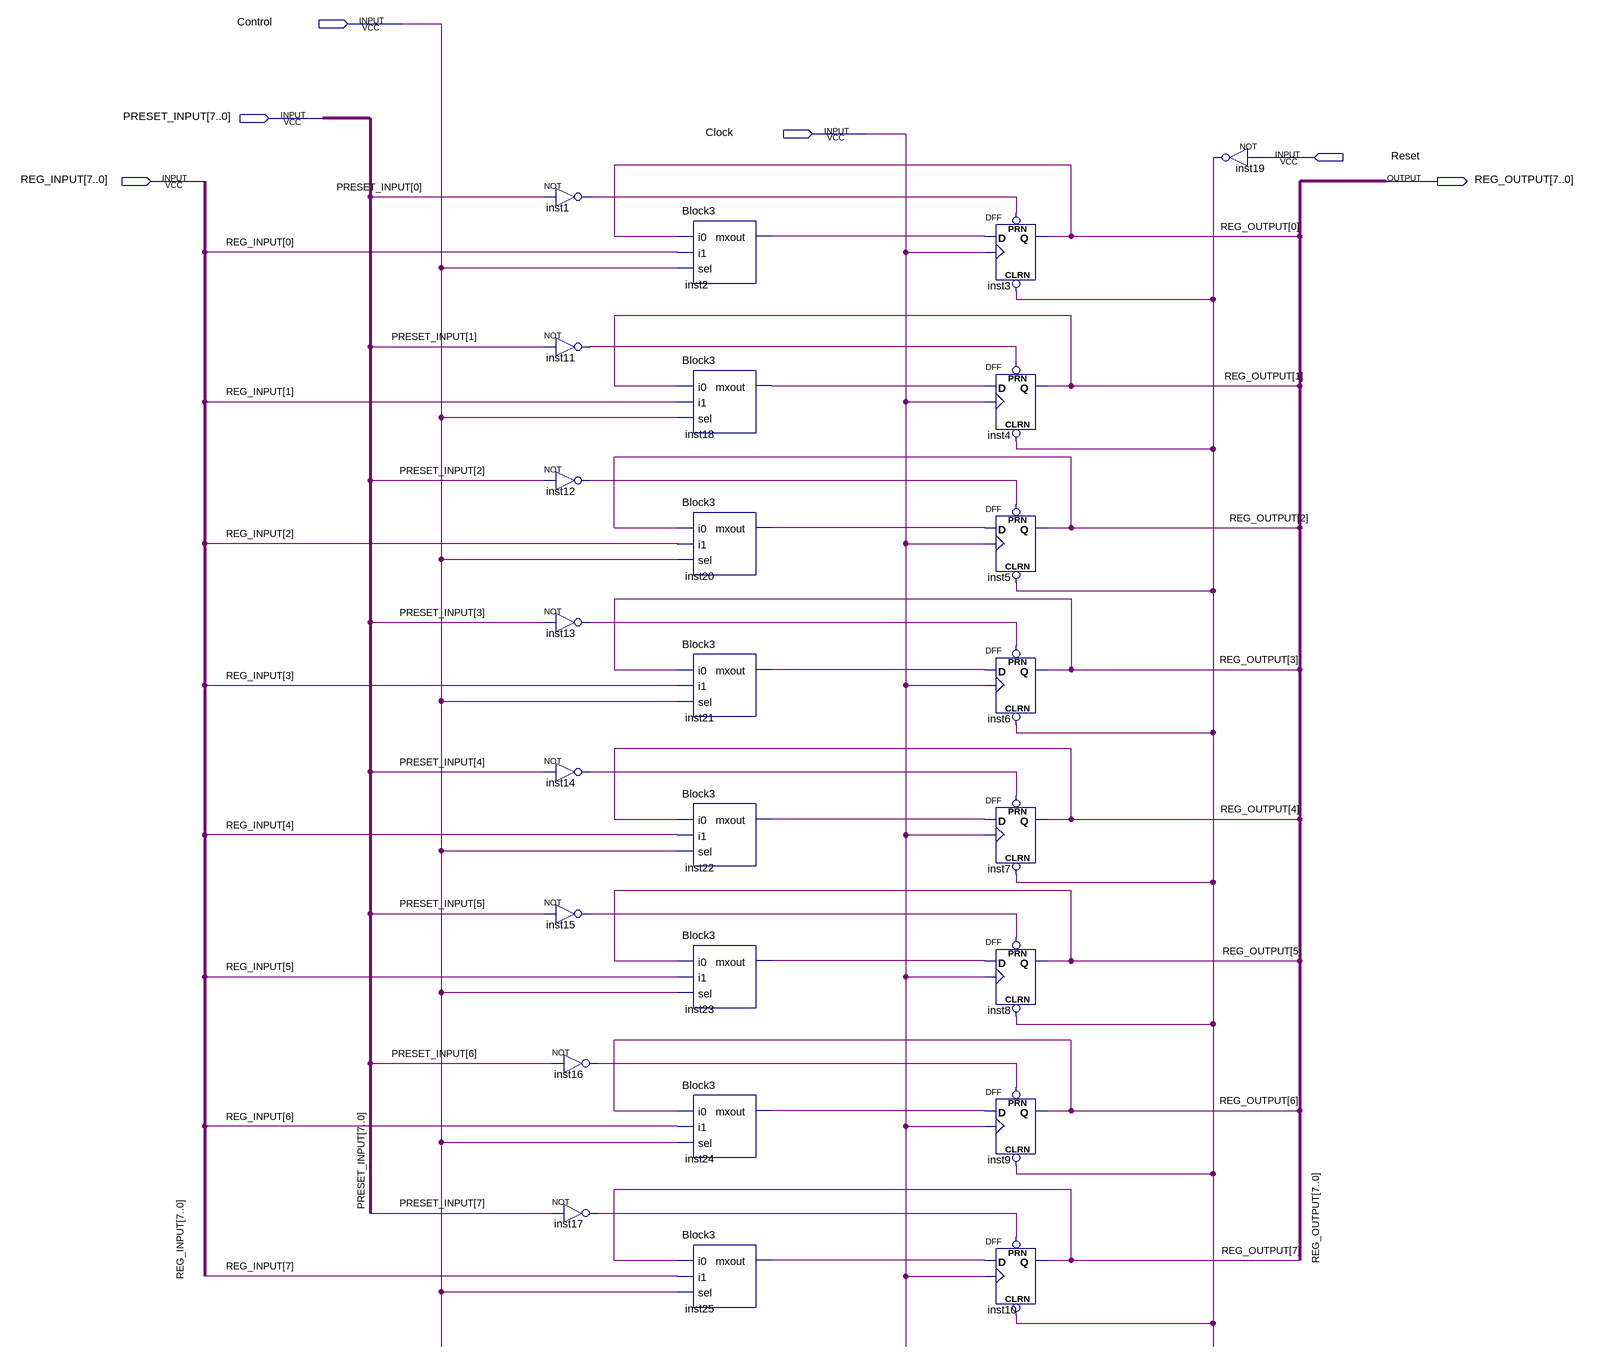
[diagram p0: schematic sheet]
// Quartus schematic Registers8bit_with_preset.bdf as structural Verilog: 25 symbols, 6 pins
module Registers8bit_with_preset (
  input  Control,
  input  [7:0] PRESET_INPUT,
  input  Clock,
  input  Reset,
  input  [7:0] REG_INPUT,
  output [7:0] REG_OUTPUT
);

  wire inst1_out, inst2_mxout, inst11_out, inst12_out, inst13_out, inst14_out, inst15_out, inst16_out,
       inst17_out, inst18_mxout, inst19_out, inst20_mxout, inst21_mxout, inst22_mxout, inst23_mxout,
       inst24_mxout, inst25_mxout;

  not inst1 (inst1_out, PRESET_INPUT[0]);
  not inst11 (inst11_out, PRESET_INPUT[1]);
  not inst12 (inst12_out, PRESET_INPUT[2]);
  not inst13 (inst13_out, PRESET_INPUT[3]);
  not inst14 (inst14_out, PRESET_INPUT[4]);
  not inst15 (inst15_out, PRESET_INPUT[5]);
  not inst16 (inst16_out, PRESET_INPUT[6]);
  not inst17 (inst17_out, PRESET_INPUT[7]);
  Block3 inst2 (.i0(REG_OUTPUT[0]), .i1(REG_INPUT[0]), .sel(Control), .mxout(inst2_mxout));
  Block3 inst18 (.i0(REG_OUTPUT[1]), .i1(REG_INPUT[1]), .sel(Control), .mxout(inst18_mxout));
  Block3 inst20 (.i0(REG_OUTPUT[2]), .i1(REG_INPUT[2]), .sel(Control), .mxout(inst20_mxout));
  Block3 inst21 (.i0(REG_OUTPUT[3]), .i1(REG_INPUT[3]), .sel(Control), .mxout(inst21_mxout));
  Block3 inst22 (.i0(REG_OUTPUT[4]), .i1(REG_INPUT[4]), .sel(Control), .mxout(inst22_mxout));
  Block3 inst23 (.i0(REG_OUTPUT[5]), .i1(REG_INPUT[5]), .sel(Control), .mxout(inst23_mxout));
  Block3 inst24 (.i0(REG_OUTPUT[6]), .i1(REG_INPUT[6]), .sel(Control), .mxout(inst24_mxout));
  Block3 inst25 (.i0(REG_OUTPUT[7]), .i1(REG_INPUT[7]), .sel(Control), .mxout(inst25_mxout));
  DFF inst3 (.CLRN(inst19_out), .CLK(Clock), .D(inst2_mxout), .PRN(inst1_out), .Q(REG_OUTPUT[0]));
  DFF inst4 (.CLRN(inst19_out), .CLK(Clock), .D(inst18_mxout), .PRN(inst11_out), .Q(REG_OUTPUT[1]));
  DFF inst5 (.CLRN(inst19_out), .CLK(Clock), .D(inst20_mxout), .PRN(inst12_out), .Q(REG_OUTPUT[2]));
  DFF inst6 (.CLRN(inst19_out), .CLK(Clock), .D(inst21_mxout), .PRN(inst13_out), .Q(REG_OUTPUT[3]));
  DFF inst7 (.CLRN(inst19_out), .CLK(Clock), .D(inst22_mxout), .PRN(inst14_out), .Q(REG_OUTPUT[4]));
  DFF inst8 (.CLRN(inst19_out), .CLK(Clock), .D(inst23_mxout), .PRN(inst15_out), .Q(REG_OUTPUT[5]));
  DFF inst9 (.CLRN(inst19_out), .CLK(Clock), .D(inst24_mxout), .PRN(inst16_out), .Q(REG_OUTPUT[6]));
  DFF inst10 (.CLRN(inst19_out), .CLK(Clock), .D(inst25_mxout), .PRN(inst17_out), .Q(REG_OUTPUT[7]));
  not inst19 (inst19_out, Reset);
endmodule
